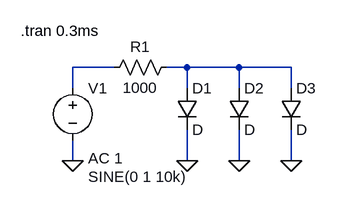
[diagram p0: schematic diode_clip_3nd_ord.asc]
diode_clip_3nd_ord.asc, the LTspice schematic file:
Version 4.1
SHEET 1 880 680
WIRE -96 64 -160 64
WIRE 16 64 -16 64
WIRE 96 64 16 64
WIRE 176 64 96 64
WIRE -160 96 -160 64
WIRE 16 96 16 64
WIRE 96 96 96 64
WIRE 176 96 176 64
WIRE -160 208 -160 176
WIRE 16 208 16 160
WIRE 96 208 96 160
WIRE 176 208 176 160
FLAG 16 208 0
FLAG -160 208 0
FLAG 96 208 0
FLAG 176 208 0
SYMBOL voltage -160 80 R0
WINDOW 123 24 124 Left 2
WINDOW 39 0 0 Left 0
WINDOW 3 24 152 Left 2
SYMATTR Value2 AC 1
SYMATTR Value SINE(0 1 10k)
SYMATTR InstName V1
SYMBOL diode 0 96 R0
SYMATTR InstName D1
SYMBOL res 0 48 R90
WINDOW 0 0 56 VBottom 2
WINDOW 3 32 56 VTop 2
SYMATTR InstName R1
SYMATTR Value 1000
SYMBOL diode 80 96 R0
SYMATTR InstName D2
SYMBOL diode 160 96 R0
SYMATTR InstName D3
TEXT -240 8 Left 2 !.tran 0.3ms

The netlist it stands for:
* diode_clip_3nd_ord.asc
V1 N001 0 SINE(0 1 10k) AC 1
D1 N002 0 D
R1 N002 N001 1000
D2 N002 0 D
D3 N002 0 D
.model D D
.lib standard.dio
.tran 0.3ms
.backanno
.end